# EAGLE design satshakit_mini_fc (EAGLE 7.7.0)
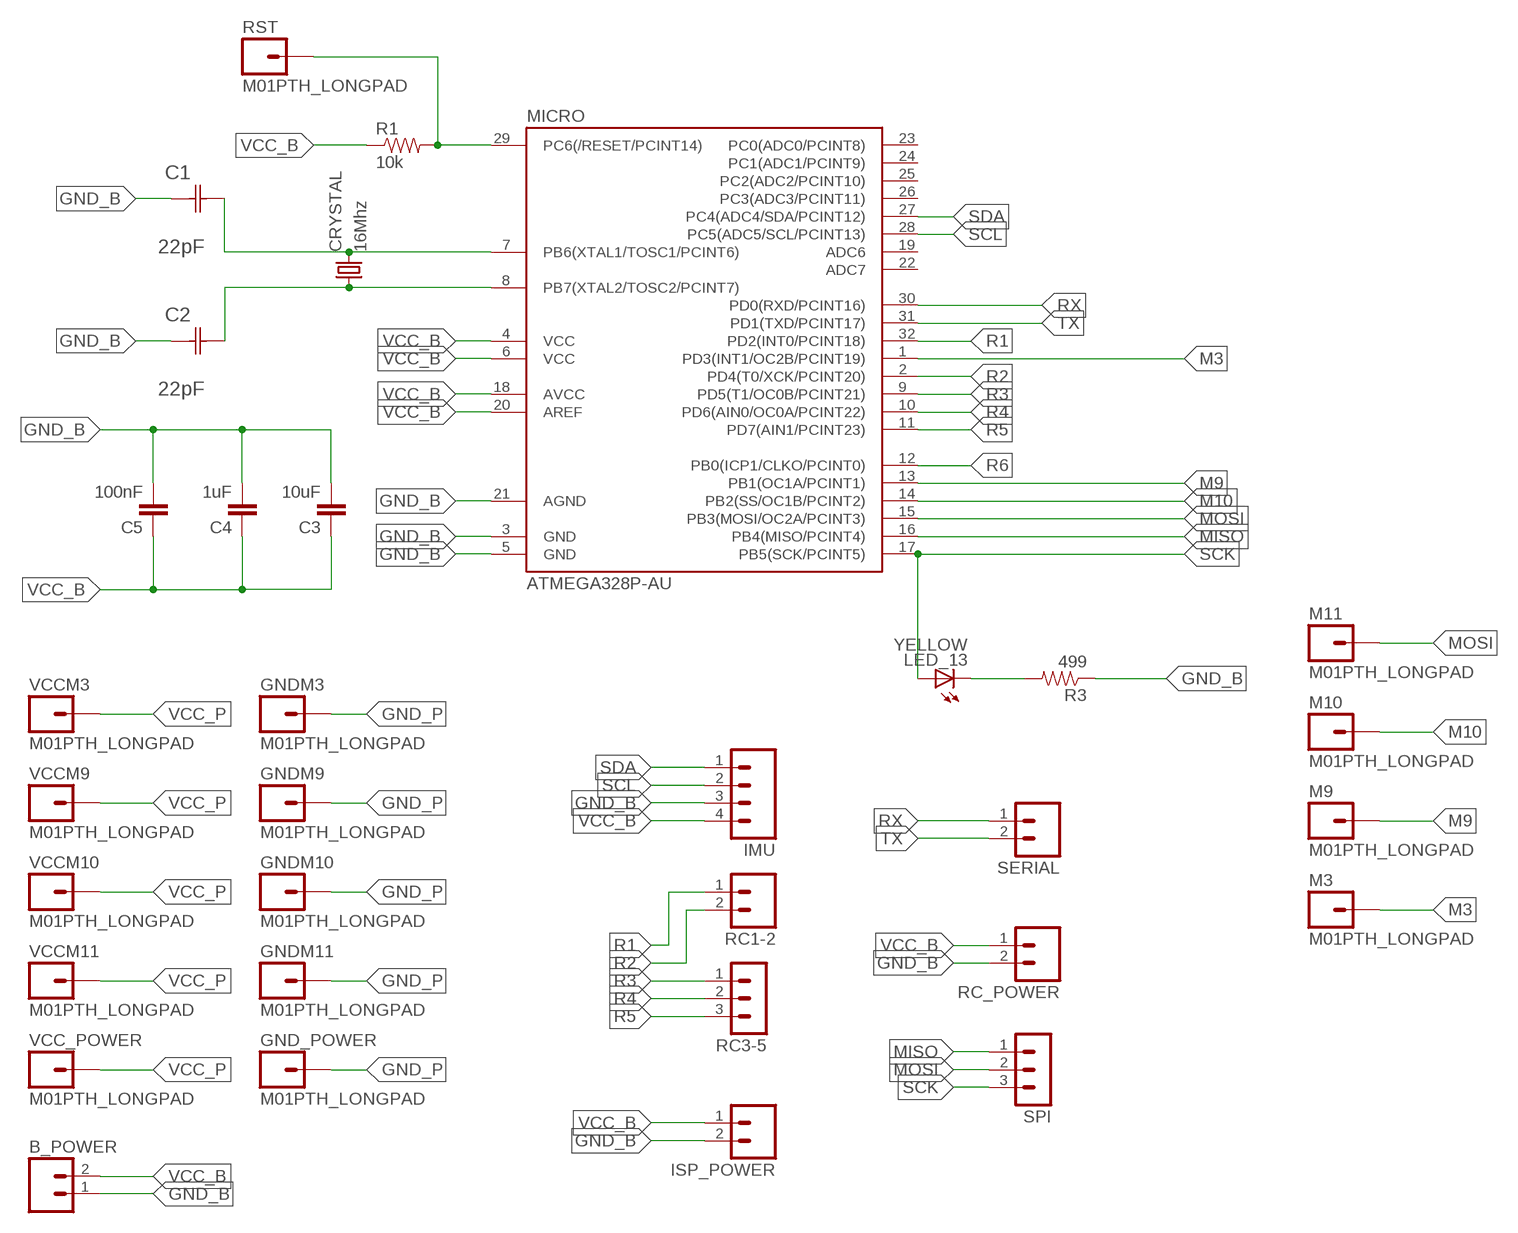
[diagram p0: schematic, sheet 1]

## Parts
B_POWER  M02LOCK_LONGPADS  [1X02_LOCK_LONGPADS]
C1  22pF  0612ZC225MAT2A  [CAPC3216X178N]
C2  22pF  0612ZC225MAT2A  [CAPC3216X178N]
C3  10uF  CAP1206  [1206]
C4  1uF  CAP1206  [1206]
C5  100nF  CAP1206  [1206]
CRYSTAL  16Mhz  CSM-7X-DU  [CSM-7X-DU]
GND_POWER  M01PTH_LONGPAD  [1X01_LONGPAD]
GNDM3  M01PTH_LONGPAD  [1X01_LONGPAD]
GNDM9  M01PTH_LONGPAD  [1X01_LONGPAD]
GNDM10  M01PTH_LONGPAD  [1X01_LONGPAD]
GNDM11  M01PTH_LONGPAD  [1X01_LONGPAD]
IMU  M04  [04P]
ISP_POWER  M02LOCK_LONGPADS  [1X02_LOCK_LONGPADS]
LED_13  YELLOW  LED1206  [1206]
M3  M01PTH_LONGPAD  [1X01_LONGPAD]
M9  M01PTH_LONGPAD  [1X01_LONGPAD]
M10  M01PTH_LONGPAD  [1X01_LONGPAD]
M11  M01PTH_LONGPAD  [1X01_LONGPAD]
MICRO  ATMEGA328P-AU  ATMEGA48/88/168-AU  [TQFP32-08]
R1  10k  RESISTOR1206  [1206]
R3  499  RESISTOR1206  [1206]
RC1-2  M02  [02P]
RC3-5  MA03-1  [MA03-1]
RC_POWER  M02LOCK_LONGPADS  [1X02_LOCK_LONGPADS]
RST  M01PTH_LONGPAD  [1X01_LONGPAD]
SERIAL  M02LOCK_LONGPADS  [1X02_LOCK_LONGPADS]
SPI  MA03-1  [MA03-1]
VCC_POWER  M01PTH_LONGPAD  [1X01_LONGPAD]
VCCM3  M01PTH_LONGPAD  [1X01_LONGPAD]
VCCM9  M01PTH_LONGPAD  [1X01_LONGPAD]
VCCM10  M01PTH_LONGPAD  [1X01_LONGPAD]
VCCM11  M01PTH_LONGPAD  [1X01_LONGPAD]

## Nets
GND_B: B_POWER.1 C1.1(C1) C2.1(C1) C3.2 C4.2 C5.2 IMU.3 ISP_POWER.2 MICRO.3(GND) MICRO.5(GND) MICRO.21(AGND) R3.1 RC_POWER.2
GND_P: GND_POWER.1 GNDM3.1 GNDM9.1 GNDM10.1 GNDM11.1
M3: M3.1 MICRO.1(PD3(INT1/OC2B/PCINT19))
M9: M9.1 MICRO.13(PB1(OC1A/PCINT1))
M10: M10.1 MICRO.14(PB2(SS/OC1B/PCINT2))
MISO: MICRO.16(PB4(MISO/PCINT4)) SPI.1
MOSI: M11.1 MICRO.15(PB3(MOSI/OC2A/PCINT3)) SPI.2
N$2: C1.2(C2) CRYSTAL.2 MICRO.7(PB6(XTAL1/TOSC1/PCINT6))
N$3: MICRO.29(PC6(/RESET/PCINT14)) R1.2 RST.1
N$9: C2.2(C2) CRYSTAL.1 MICRO.8(PB7(XTAL2/TOSC2/PCINT7))
N$27: LED_13.2(C) R3.2
R1: MICRO.32(PD2(INT0/PCINT18)) RC1-2.1
R2: MICRO.2(PD4(T0/XCK/PCINT20)) RC1-2.2
R3: MICRO.9(PD5(T1/OC0B/PCINT21)) RC3-5.1
R4: MICRO.10(PD6(AIN0/OC0A/PCINT22)) RC3-5.2
R5: MICRO.11(PD7(AIN1/PCINT23)) RC3-5.3
R6: MICRO.12(PB0(ICP1/CLKO/PCINT0))
RX: MICRO.30(PD0(RXD/PCINT16)) SERIAL.1
SCK: LED_13.1(A) MICRO.17(PB5(SCK/PCINT5)) SPI.3
SCL: IMU.2 MICRO.28(PC5(ADC5/SCL/PCINT13))
SDA: IMU.1 MICRO.27(PC4(ADC4/SDA/PCINT12))
TX: MICRO.31(PD1(TXD/PCINT17)) SERIAL.2
VCC_B: B_POWER.2 C3.1 C4.1 C5.1 IMU.4 ISP_POWER.1 MICRO.4(VCC) MICRO.6(VCC) MICRO.18(AVCC) MICRO.20(AREF) R1.1 RC_POWER.1
VCC_P: VCC_POWER.1 VCCM3.1 VCCM9.1 VCCM10.1 VCCM11.1
Unconnected: MICRO.19(ADC6) MICRO.22(ADC7) MICRO.23(PC0(ADC0/PCINT8)) MICRO.24(PC1(ADC1/PCINT9)) MICRO.25(PC2(ADC2/PCINT10)) MICRO.26(PC3(ADC3/PCINT11))

## Library data of the parts
B_POWER ISP_POWER RC_POWER SERIAL = 01_SparkFun:M02: Header 2 Standard 2-pin 0.1" header. Use with straight break away headers (SKU : PRT-00116), right angle break away headers (PRT-00553), swiss pins (PRT-00743), machine pins (PRT-00117), and female headers (PRT-00115). Molex polarized connector foot print use with SKU : PRT-08233 with associated crimp pins and housings.
C1 C2 = AVX_By_element14_Batch_1:0612ZC225MAT2A: Capacitor 1206; MPN: 0612ZC225MAT2A; OC_FARNELL: -; OC_NEWARK: 12N3209; SUPPLIER: AVX; TOLERANCE: ±20%; VALUE: 2.2µF; VOLTAGERATING: 10V
C3-C5 = 01_SparkFun:CAP: Capacitor Standard 0603 ceramic capacitor, and 0.1" leaded capacitor.
CRYSTAL = 01_FAB_Hello:CSM-7X-DU: SMD CRYSTAL Source: www.ecsxtal.com .. Crystal 3.6864MHz CSM_7X_DU.PDF; OC_FARNELL: unknown; OC_NEWARK: unknown
GND_POWER GNDM3 GNDM9-GNDM11 M3 M9-M11 RST VCC_POWER VCCM3 VCCM9-VCCM11 = 01_SparkFun:M01: Header 1 Standard 1-pin 0.1" header. Use with straight break away headers (SKU : PRT-00116), right angle break away headers (PRT-00553), swiss pins (PRT-00743), machine pins (PRT-00117), and female headers (PRT-00115).
IMU = con-amp-quick:M04: AMP QUICK CONNECTOR; OC_FARNELL: unknown; OC_NEWARK: unknown
LED_13 = 01_FAB_Hello:LED
MICRO = atmega8:ATMEGA48/88/168
R1 R3 = 01_SparkFun:RESISTOR: Resistor Basic schematic elements and footprints for 0603, 1206, and PTH 1/10th watt (small) resistors.
RC1-2 = con-amp-quick:M02: AMP QUICK CONNECTOR; OC_FARNELL: unknown; OC_NEWARK: unknown
RC3-5 SPI = con-lstb:MA03-1: PIN HEADER; OC_FARNELL: unknown; OC_NEWARK: unknown

## Board
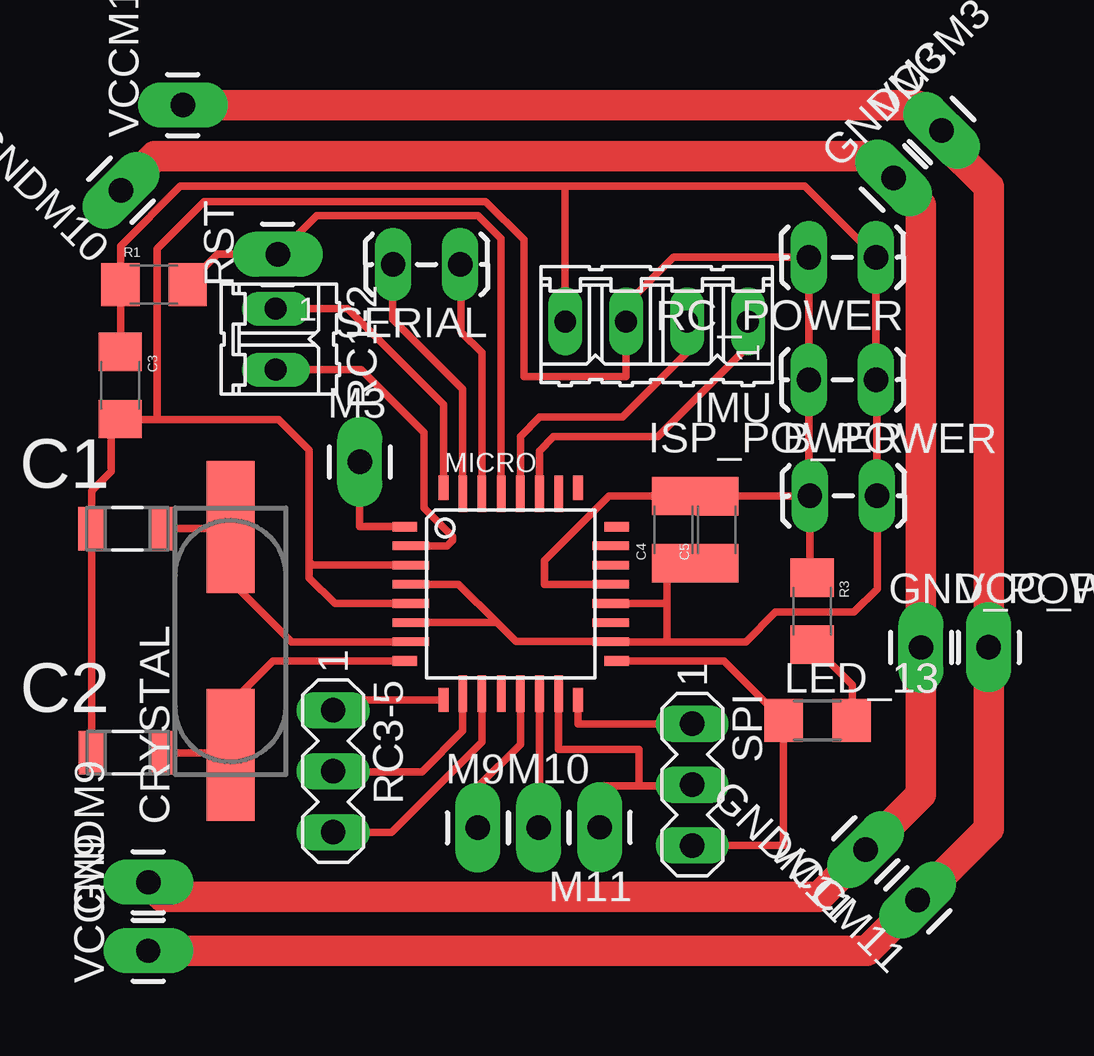
[diagram p1: board, top side]

No outline drawn. Coordinates in mm, seen from the top.
Copper layers (1*16): Top 0.035mm / dielectric 1.5mm / Bottom 0.035mm
Design rules "default": minimum track width 10mil, minimum drill 24mil, track to track 8mil, track to pad 8mil, pad to pad 8mil, via to via 8mil, smd to smd 8mil, copper to edge 40mil, drill to drill 8mil, minimum pad ring 10mil, minimum via ring 8mil, stop-mask expansion 4mil, vias tented up to drill 0mil, thermal gap 10mil

### Footprints (pad centres in the part's own frame; a part is rotated, then mirrored left to right if it is on the bottom)
1X02_LOCK_LONGPADS = drill 1.016 long: 1 -0.127,0; 2 2.667,0
CAPC3216X178N = smd 1.118 x 1.803: 1 -1.499,0; 2 1.499,0
1206 = smd 1.6 x 1.8: 1 -1.4,0; 2 1.4,0
CSM-7X-DU = smd 5.5 x 2: 1 -4.75,0; 2 4.75,0
1X01_LONGPAD = drill 1.016 pad 1.88 long: 1 0,0
04P = drill 0.914 long: 1 -3.81,0; 2 -1.27,0; 3 1.27,0; 4 3.81,0
1206' = smd 1.6 x 1.803: 1 -1.422,0; 2 1.422,0
TQFP32-08 = smd 1.016 x 0.406: 1 -4.42,2.8; 8 -4.42,-2.8; 17 4.42,-2.8; 24 4.42,2.8 | smd 1.524 x 0.356: 2 -4.166,2; 3 -4.166,1.2; 4 -4.166,0.4; 5 -4.166,-0.4; 6 -4.166,-1.2; 7 -4.166,-2; 18 4.166,-2; 19 4.166,-1.2; 20 4.166,-0.4; 21 4.166,0.4; 22 4.166,1.2; 23 4.166,2 | smd 0.406 x 1.016: 9 -2.8,-4.42; 16 2.8,-4.42; 25 2.8,4.42; 32 -2.8,4.42 | smd 0.356 x 1.524: 10 -2,-4.166; 11 -1.2,-4.166; 12 -0.4,-4.166; 13 0.4,-4.166; 14 1.2,-4.166; 15 2,-4.166; 26 2,4.166; 27 1.2,4.166; 28 0.4,4.166; 29 -0.4,4.166; 30 -1.2,4.166; 31 -2,4.166
02P = drill 0.914 long: 1 -1.27,0; 2 1.27,0
MA03-1 = drill 1.016 long: 1 -2.54,0; 2 0,0; 3 2.54,0

### Placement (x,y rotation side)
B_POWER  61.74,45.41 0 top
C1  33.16,44.05 0 top
C2  33.18,34.7 0 top
C3  32.86,50.01 270 top
C4  55.92,44 90 top
C5  57.73,44 90 top
CRYSTAL  37.45,39.36 90 top
GND_POWER  66.24,39.09 0 top
GNDM3  65.1,58.66 45 top
GNDM9  34.03,29.3 90 top
GNDM10  32.89,58.15 135 top
GNDM11  63.94,30.66 135 top
IMU  55.22,52.68 180 top
ISP_POWER  64.23,50.25 180 top
LED_13  YELLOW  [1206']  61.93,36.05 0 top
M3  42.84,46.83 0 top
M9  47.76,31.58 0 top
M10  50.31,31.58 0 top
M11  52.85,31.59 180 top
MICRO  49.14,41.33 0 top
R1  34.27,54.22 0 top
R3  61.7,40.61 270 top
RC1-2  39.34,51.94 270 top
RC3-5  41.73,33.93 270 top
RC_POWER  64.23,55.36 180 top
RST  39.43,55.48 90 top
SERIAL  46.9,55.06 180 top
SPI  56.71,33.37 270 top
VCC_POWER  69.06,39.1 0 top
VCCM3  67.09,60.64 45 top
VCCM9  34.03,26.45 90 top
VCCM10  35.47,61.7 90 top
VCCM11  66.1,28.57 135 top

### Tracks (layer width: path | path; a pad name or v marks a point on that pad's centre or on a via)
GND_B
  Top 0.305: 42.8,42.53 MICRO.3 40.89,42.53 40.74,42.67 | MICRO.5 44.97,40.92 41.81,40.92 40.74,41.99 40.74,42.67 | MICRO.21 50.55,41.73 50.55,42.72 53.23,45.4 C4.2 C5.2 B_POWER.1 | 32.89,48.59 C3.2 | 40.74,42.67 40.74,47.32 39.47,48.59 34.39,48.59 | 34.39,48.59 32.89,48.59 | C2.1 31.68,44.05 C1.1 31.66,45.61 32.49,46.43 32.49,47.84 32.31,48.01 32.89,48.59 | R3.1 61.61,42.1 B_POWER.1 | B_POWER.1 61.57,45.45 ISP_POWER.2 RC_POWER.2 55.92,55.36 53.95,53.39 IMU.3 53.95,50.39 49.68,50.39 49.68,56.08 48.08,57.68 36.35,57.68 34.39,55.73 34.39,48.59
GND_P
  Top 1.27: GND_POWER.1 66.22,39.09 | GND_POWER.1 66.24,32.96 GNDM11.1 61.98,28.7 34.63,28.7 GNDM9.1 | GND_POWER.1 66.24,57.53 GNDM3.1 64.2,59.56 34.3,59.56 GNDM10.1
M3
  Top 0.305: MICRO.1 42.84,44.13 M3.1
M9
  Top 0.305: MICRO.13 49.54,35.06 47.78,33.3 47.78,31.59 M9.1
M10
  Top 0.305: MICRO.14 50.34,31.58 M10.1
MISO
  Top 0.305: SPI.1 51.94,35.91 MICRO.16
MOSI
  Top 0.305: MICRO.15 51.14,34.84 54.48,34.84 54.48,33.33 | M11.1 52.86,31.61 52.86,32.59 52.86,33.12 52.86,33.33 54.48,33.33 | 54.48,33.33 56.71,33.33 SPI.2
N$2
  Top 0.305: MICRO.7 40,39.33 37.49,41.83 37.49,44.07 CRYSTAL.2 37.45,44.05 C1.2
N$3
  Top 0.305: R1.2 36.93,55.48 RST.1 41.05,57.1 47.78,57.1 48.74,56.14 MICRO.29
N$9
  Top 0.305: C2.2 37.45,34.7 CRYSTAL.1 37.49,34.65 37.49,36.78 39.24,38.53 MICRO.8
N$27
  Top 0.305: LED_13.2 63.38,36.07 63.38,37.53 R3.2
R1
  Top 0.305: MICRO.32 46.34,49.22 42.34,53.21 RC1-2.1
R2
  Top 0.305: MICRO.2 46.48,43.33 46.71,43.56 46.71,43.71 45.52,44.91 45.52,48.06 42.9,50.67 RC1-2.2
R3
  Top 0.305: MICRO.9 42.16,36.91 RC3-5.1
R4
  Top 0.305: MICRO.10 47.14,35.6 45.44,33.91 41.76,33.91 RC3-5.2
R5
  Top 0.305: MICRO.11 47.94,35.16 44.17,31.39 RC3-5.3
RX
  Top 0.305: MICRO.30 47.94,51.38 47.07,52.25 47.07,55.02 SERIAL.1
SCK
  Top 0.305: SPI.3 60.51,30.83 LED_13.1 58.03,38.53 MICRO.17
SCL
  Top 0.305: MICRO.28 49.54,47.88 50.34,48.69 53.8,48.69 56.49,51.38 IMU.2
SDA
  Top 0.305: MICRO.27 50.34,47.29 50.93,47.88 55.27,47.88 59.05,51.66 59.05,52.65 IMU.1
TX
  Top 0.305: MICRO.31 47.14,49.87 44.22,52.78 44.22,55.04 SERIAL.2
VCC_B
  Top 0.305: 55.65,39.33 MICRO.18 53.28,39.34 49.35,39.34 48.57,40.13 | MICRO.20 55.65,40.93 | MICRO.6 48.57,40.13 | MICRO.4 46.97,41.73 48.57,40.13 | C3.1 32.84,51.41 32.87,51.44 R1.1 32.87,55.83 35.36,58.32 51.41,58.32 | 55.65,39.33 55.65,40.93 | 55.65,40.93 55.65,42.33 C4.1 C5.1 | 55.65,39.33 58.94,39.33 60.17,40.56 63.45,40.56 64.41,41.53 64.41,45.4 B_POWER.2 64.4,50.21 ISP_POWER.1 RC_POWER.1 61.4,58.32 51.41,58.32 | 51.38,52.7 IMU.4 51.41,58.32
VCC_P
  Top 1.27: VCCM10.1 66.03,61.7 VCCM3.1 67.09,60.26 69.06,58.3 VCC_POWER.1 69.06,31.53 VCCM11.1 63.98,26.45 VCCM9.1